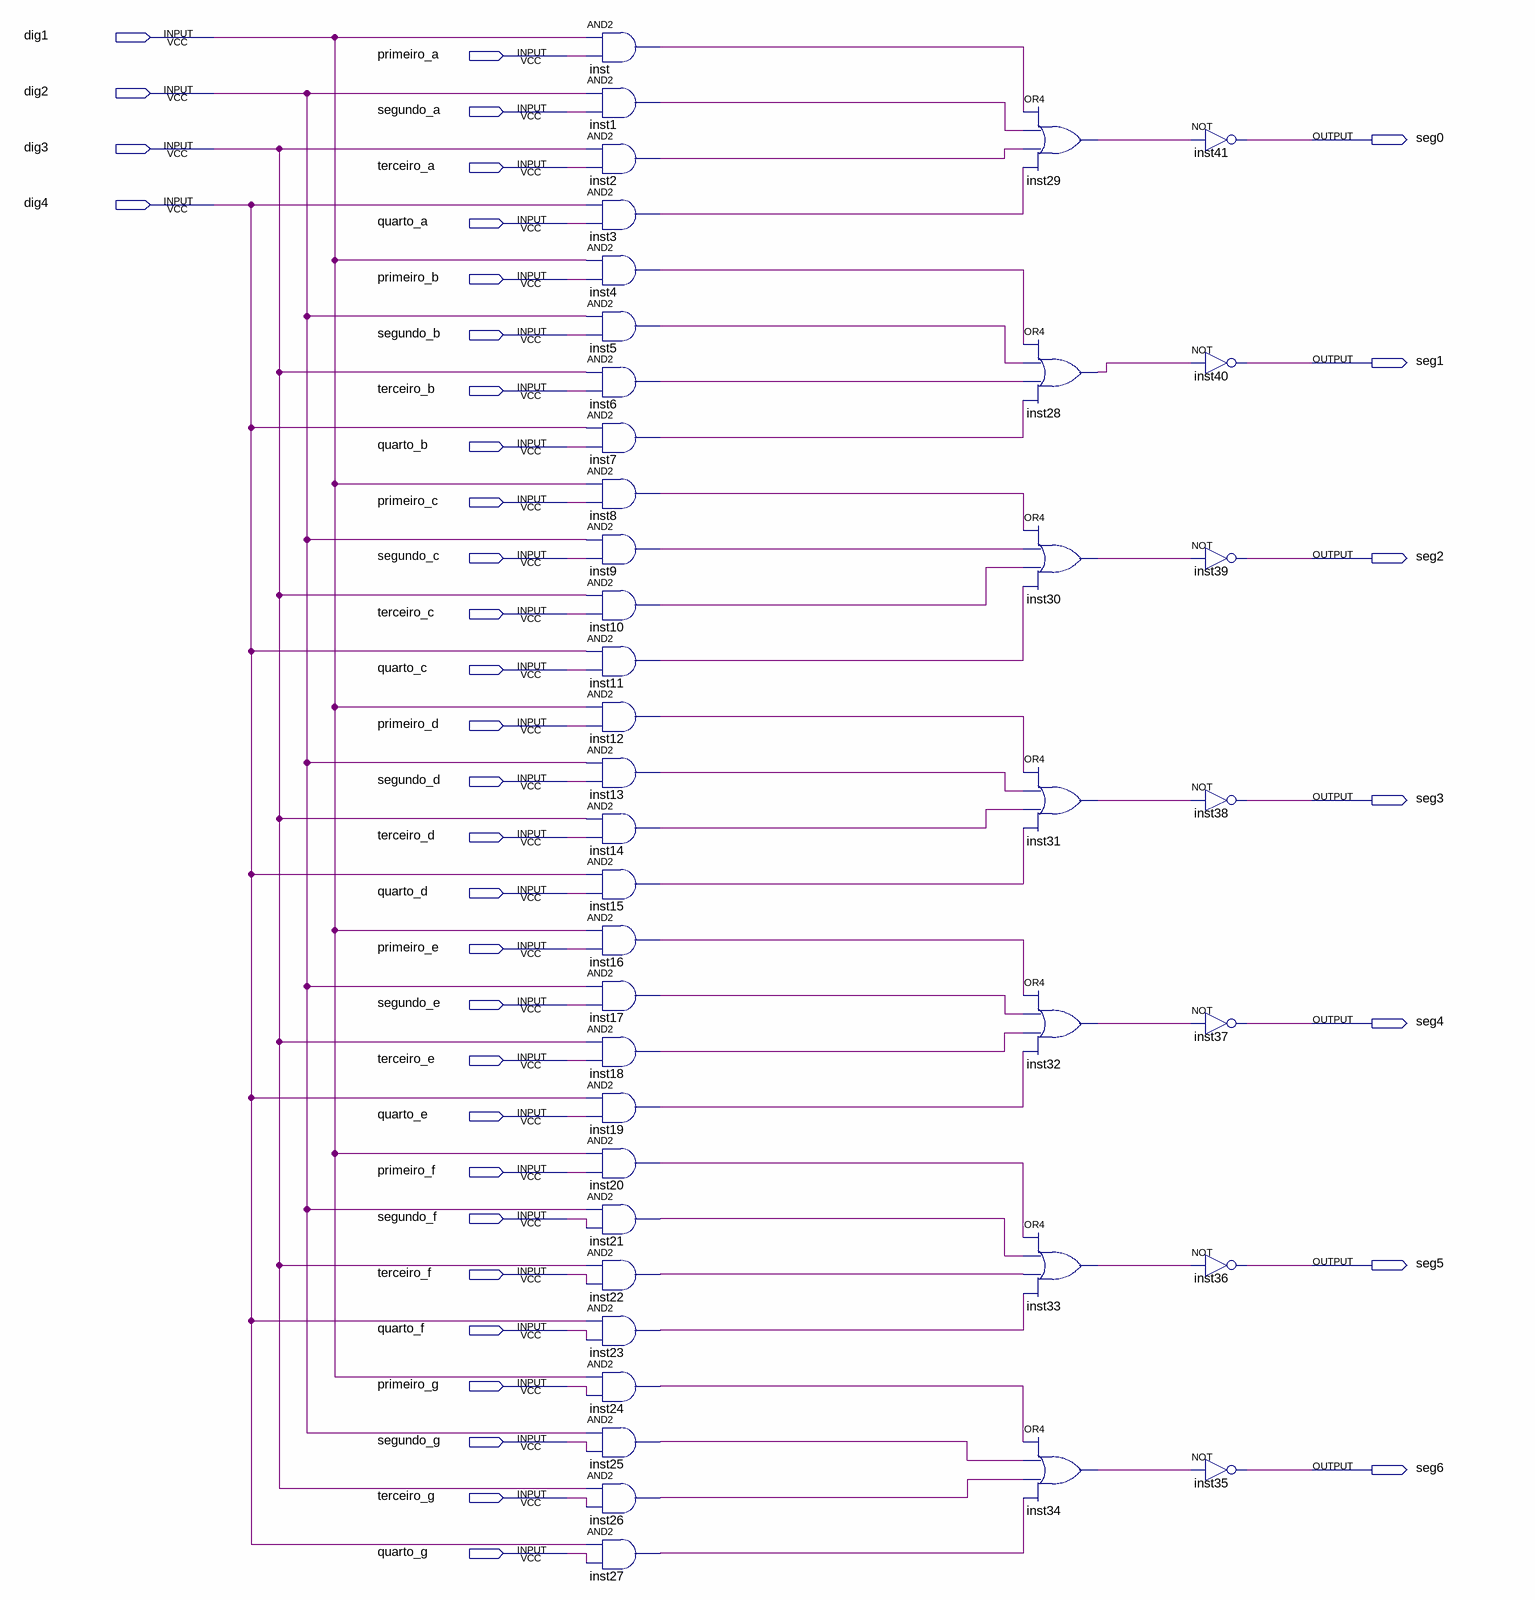
[diagram p0: schematic sheet]
// Quartus schematic Multiplexador.bdf as structural Verilog: 42 symbols, 39 pins
module Multiplexador (
  input  dig1,
  input  primeiro_a,
  input  dig2,
  input  segundo_a,
  input  dig3,
  input  terceiro_a,
  input  dig4,
  input  quarto_a,
  input  primeiro_b,
  input  segundo_b,
  input  terceiro_b,
  input  quarto_b,
  input  primeiro_c,
  input  segundo_c,
  input  terceiro_c,
  input  quarto_c,
  input  primeiro_d,
  input  segundo_d,
  input  terceiro_d,
  input  quarto_d,
  input  primeiro_e,
  input  segundo_e,
  input  terceiro_e,
  input  quarto_e,
  input  primeiro_f,
  input  segundo_f,
  input  terceiro_f,
  input  quarto_f,
  input  primeiro_g,
  input  segundo_g,
  input  terceiro_g,
  input  quarto_g,
  output seg0,
  output seg1,
  output seg2,
  output seg3,
  output seg4,
  output seg5,
  output seg6
);

  wire inst1_out, inst2_out, inst3_out, inst4_out, inst5_out, inst6_out, inst7_out, inst8_out, inst9_out,
       inst10_out, inst11_out, inst12_out, inst13_out, inst14_out, inst15_out, inst16_out, inst17_out,
       inst18_out, inst19_out, inst20_out, inst21_out, inst22_out, inst23_out, inst24_out, inst25_out,
       inst26_out, inst27_out, inst28_out, inst29_out, inst30_out, inst31_out, inst32_out, inst33_out,
       inst34_out, inst_out;

  and inst (inst_out, dig1, primeiro_a);
  and inst1 (inst1_out, dig2, segundo_a);
  and inst2 (inst2_out, dig3, terceiro_a);
  and inst3 (inst3_out, dig4, quarto_a);
  and inst4 (inst4_out, dig1, primeiro_b);
  and inst5 (inst5_out, dig2, segundo_b);
  and inst6 (inst6_out, dig3, terceiro_b);
  and inst7 (inst7_out, dig4, quarto_b);
  and inst8 (inst8_out, dig1, primeiro_c);
  and inst9 (inst9_out, dig2, segundo_c);
  and inst10 (inst10_out, dig3, terceiro_c);
  and inst11 (inst11_out, dig4, quarto_c);
  and inst12 (inst12_out, dig1, primeiro_d);
  and inst13 (inst13_out, dig2, segundo_d);
  and inst14 (inst14_out, dig3, terceiro_d);
  and inst15 (inst15_out, dig4, quarto_d);
  and inst16 (inst16_out, dig1, primeiro_e);
  and inst17 (inst17_out, dig2, segundo_e);
  and inst18 (inst18_out, dig3, terceiro_e);
  and inst19 (inst19_out, dig4, quarto_e);
  and inst20 (inst20_out, dig1, primeiro_f);
  and inst21 (inst21_out, dig2, segundo_f);
  and inst22 (inst22_out, dig3, terceiro_f);
  and inst23 (inst23_out, dig4, quarto_f);
  and inst24 (inst24_out, dig1, primeiro_g);
  and inst25 (inst25_out, dig2, segundo_g);
  and inst26 (inst26_out, dig3, terceiro_g);
  and inst27 (inst27_out, dig4, quarto_g);
  or inst29 (inst29_out, inst_out, inst1_out, inst2_out, inst3_out);
  or inst28 (inst28_out, inst4_out, inst5_out, inst6_out, inst7_out);
  or inst30 (inst30_out, inst8_out, inst9_out, inst10_out, inst11_out);
  or inst31 (inst31_out, inst12_out, inst13_out, inst14_out, inst15_out);
  or inst32 (inst32_out, inst16_out, inst17_out, inst18_out, inst19_out);
  or inst33 (inst33_out, inst20_out, inst21_out, inst22_out, inst23_out);
  or inst34 (inst34_out, inst24_out, inst25_out, inst26_out, inst27_out);
  not inst41 (seg0, inst29_out);
  not inst40 (seg1, inst28_out);
  not inst39 (seg2, inst30_out);
  not inst38 (seg3, inst31_out);
  not inst37 (seg4, inst32_out);
  not inst36 (seg5, inst33_out);
  not inst35 (seg6, inst34_out);
endmodule
